# Altium schematic sheet Sheet4.SchDoc
size A; SheetNumber: 4; SheetTotal: 5
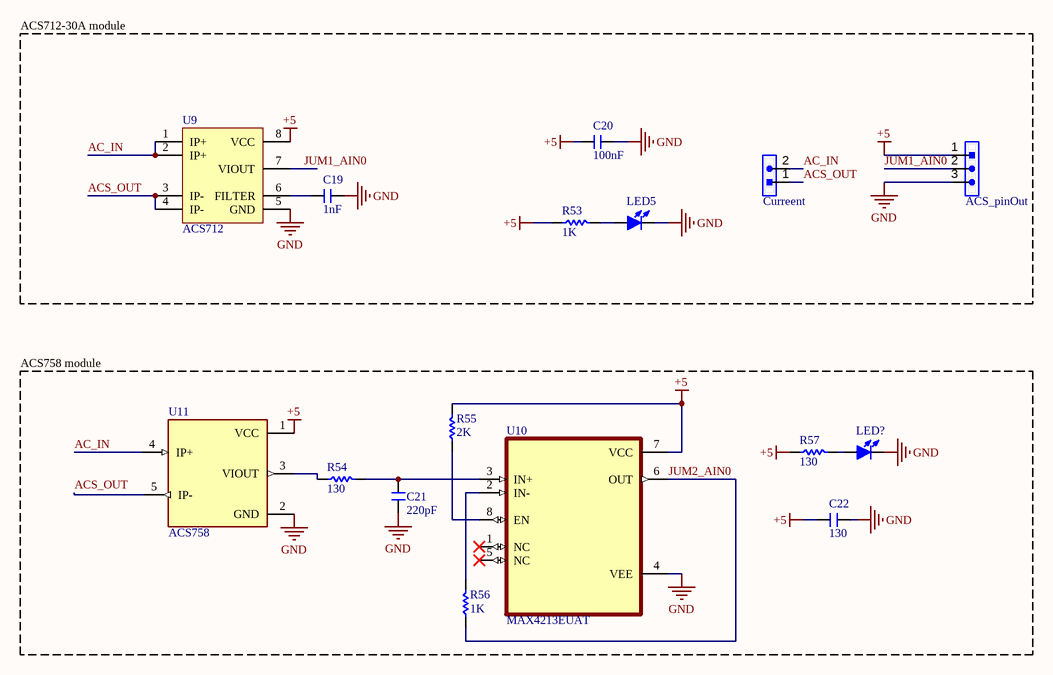
[diagram p0: Sheet4.SchDoc]

## Parts
ACS_pinOut  HDR-1X3  [HDR-1X3]  (value not drawn)
C19  1nF  [C 0805]
C20  100nF  [C 0805]
C21  220pF  [C 0805]
C22  130  [C 0805]
Curreent  HDR-1X2  [HDR-1X2]  (value not drawn)
LED5  LED-SMD  [LED 0805R]  (value not drawn)
LED?  LED-SMD  [LED 0805R]  (value not drawn)
R53  1K  [R 0805]
R54  130  [R 0805]
R55  2K  [R 0805]
R56  1K  [R 0805]
R57  130  [R 0805]
U9  ACS712  [SOP8_N]
U10  MAX4213EUAT  [SOP65P490X110-8N]
U11  ACS758  [XDCR_ACS758]

## Nets
+5: ACS_pinOut.1 C20.1 C22.1 R53.1 R55.2 R57.1 U9.8(VCC) U10.7(VCC) U11.1(VCC)
GND: ACS_pinOut.3 C19.2 C20.2 C21.1 C22.2 LED5.2(K) LED?.2(K) U9.5(GND) U10.4(VEE) U11.2(GND)
AC_IN: Curreent.2 U9.1(IP+) U9.2(IP+) U11.4(IP+)
ACS_OUT: Curreent.1 U9.3(IP-) U9.4(IP-) U11.5(IP-)
JUM1_AIN0: ACS_pinOut.2 U9.7(VIOUT)
JUM2_AIN0: R56.1 U10.6(OUT)
NetC19_1: C19.1 U9.6(FILTER)
NetC21_2: C21.2 R54.2 U10.3(IN+)
NetLED5_1: LED5.1(A) R53.2
NetLED?_1: LED?.1(A) R57.2
NetR54_1: R54.1 U11.3(VIOUT)
NetR55_1: R55.1 U10.8(EN)
NetR56_2: R56.2 U10.2(IN-)

Not connected (* = marked no-connect by the designer): U10 1(NC)* 5(NC)*

## Notes on the sheet
- ACS712-30A module
- ACS758 module

## Library data of the parts
ACS_pinOut = Header 3: 3P Connector; BOM名称: 3P接插件; 版权归属: 源创客; 学习资源: www.ooocke.com
C19-C22 = C: Non-polar patch capacitor; BOM名称: 无极性贴片电容; 版权归属: 源创客; 学习资源: www.ooocke.com
Curreent = Header 2: 2P Connector; BOM名称: 2P接插件; 版权归属: 源创客; 学习资源: www.ooocke.com
LED5 LED? = LED-SMD: Patch LED; BOM名称: 贴片LED; 版权归属: 源创客; 学习资源: www.ooocke.com
R53-R57 = R: Chip resistor; 版权归属: 源创客; BOM名称: Chip resistor; 学习资源: www.ooocke.com
U9 = ACS712: Current detection chip; BOM名称: 电流检测芯片; 版权归属: 源创客; 学习资源: www.ooocke.com
U11 = ACS758: Current Sensor 50A 1 Channel Hall Effect, Open Loop Unidirectional 5-CB Formed Leads, PFF; MF: Allegro MicroSystems LLC; Package: 5-CB-5 Allegro MicroSystems LLC; MP: ACS758; Availability: Unavailable; Price: None; Value: *; SnapEDA_Link: https://www.snapeda.com/parts/ACS758/Allegro%20MicroSystems%20LLC/view-part/226237/?ref=snap
U10 = MAX4213EUAT: Package: None; Price: None; Value: *; MP: MAX4213EUAT; Availability: Unavailable